# EasyEDA Pro project design.epro, board board_bottom_pcb
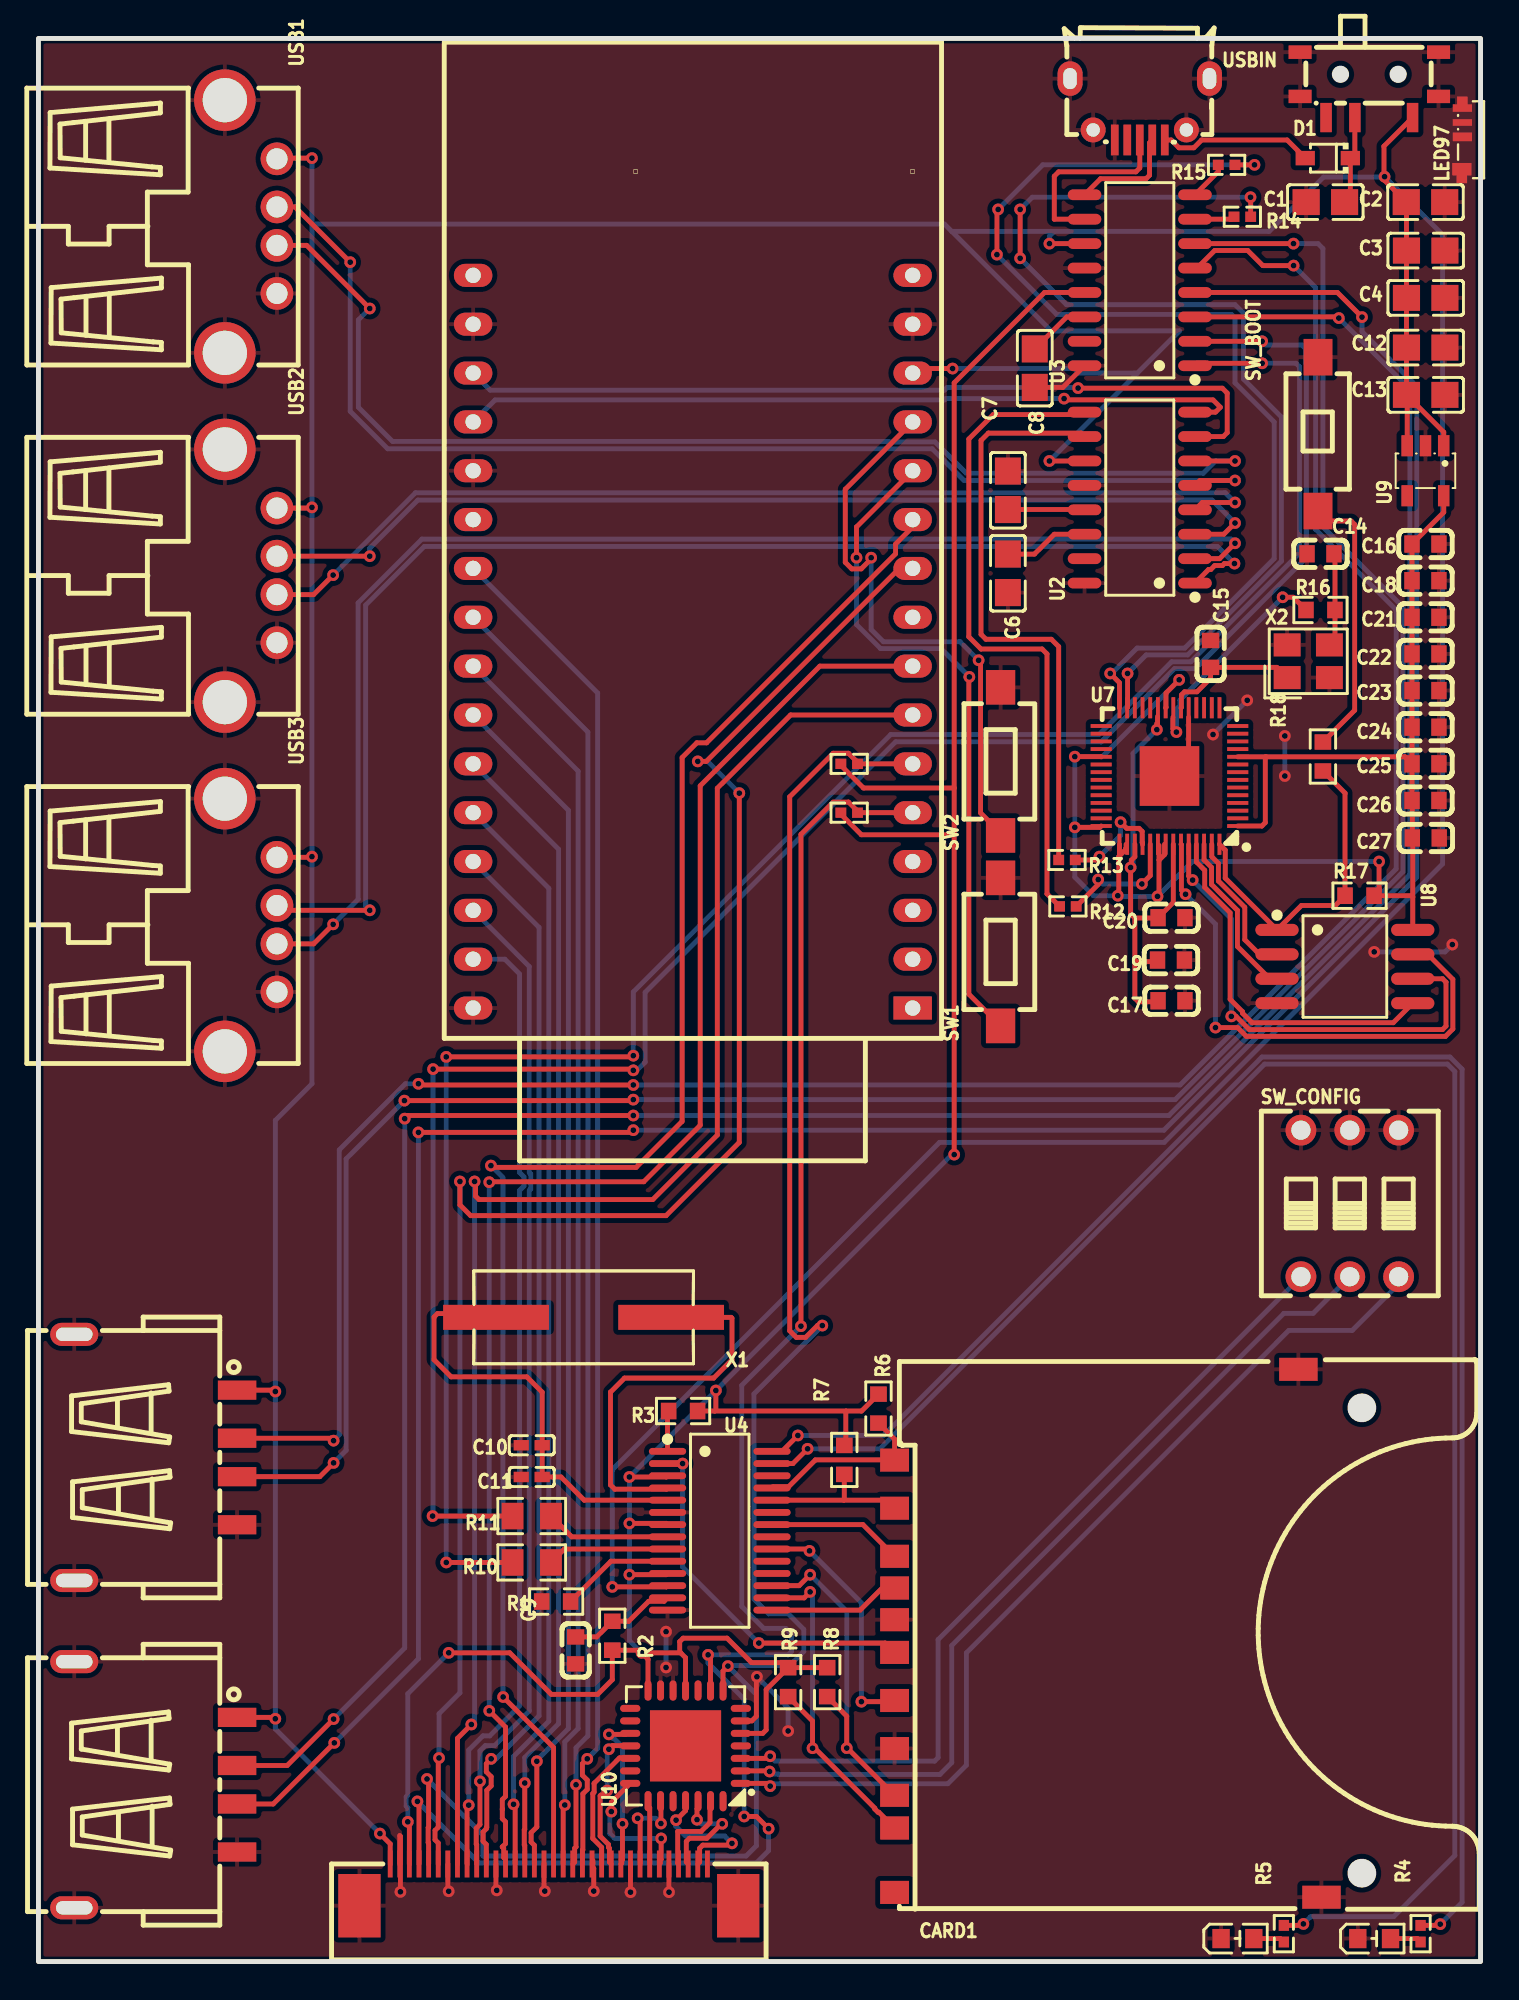
[diagram p11: board, top side]
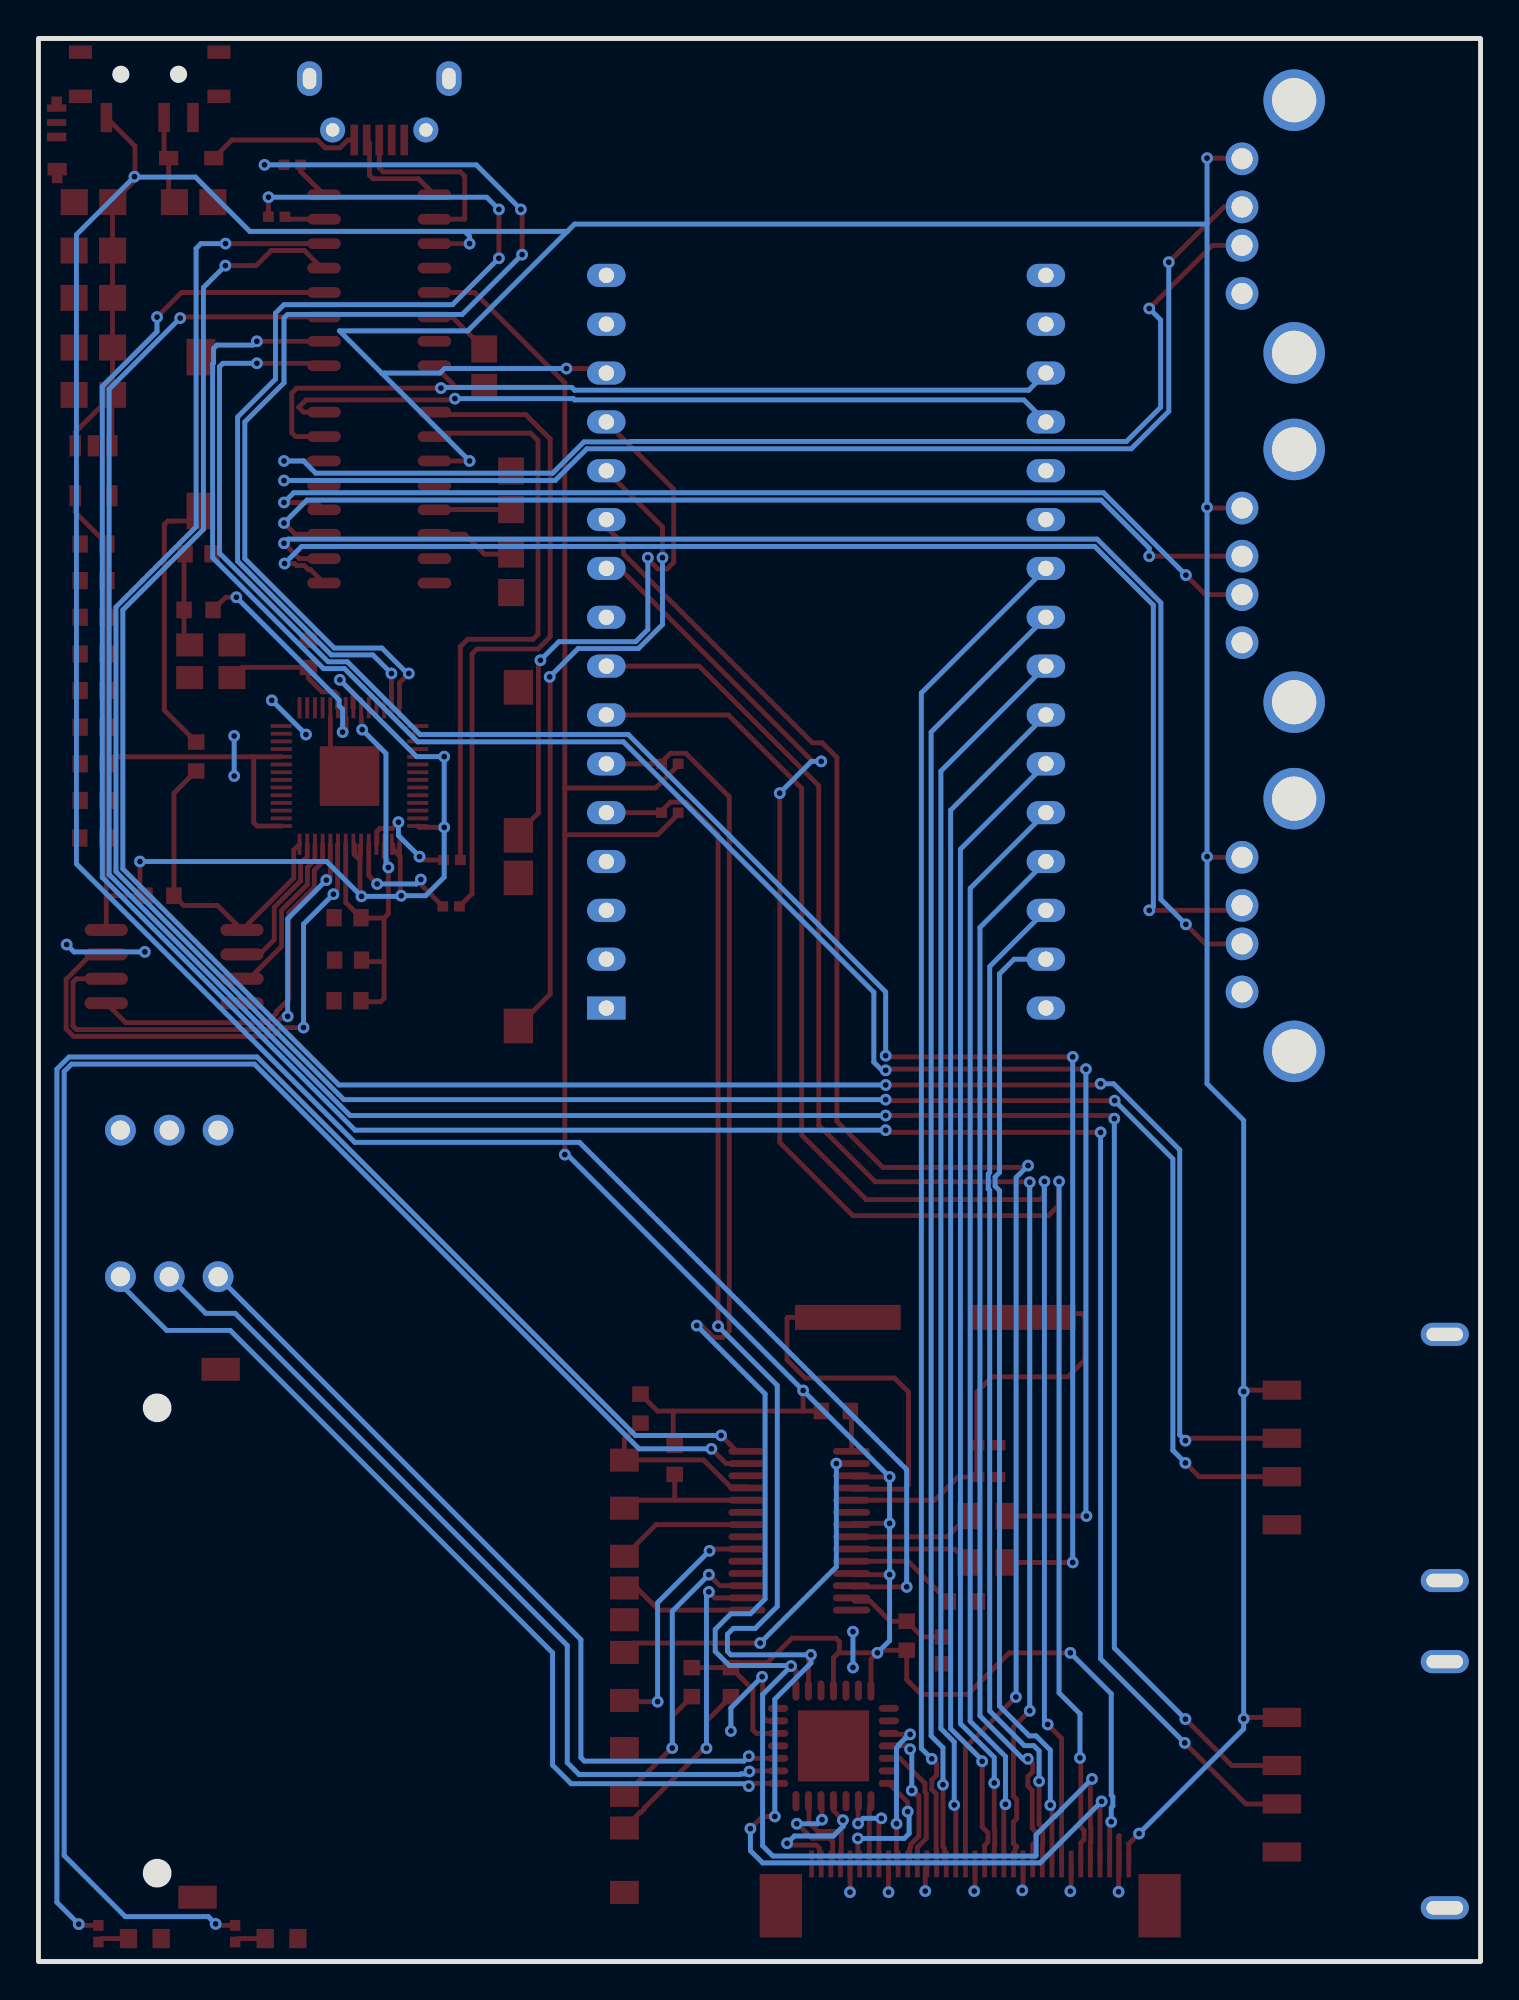
[diagram p12: board, bottom side, seen from below]

Outline 75 x 100 mm; copper layers: Top Layer, Bottom Layer. Coordinates in mm from the lower left corner of the outline.
Outline path: rectangle 0,100 75,0
Stack: Top Layer 0.035mm / Dielectric1 1.51mm FR4 er 4.5 / Bottom Layer 0.035mm

## Design rules (mm)
template: Custom Config
spacing copperThickness1oz (default): track to track 0.102, other pairs 0.152 to 0.3
spacing copperThickness2oz: track to track 0.203, other pairs 0.152 to 0.3
spacing copperThickness0.5oz: track to track 0.051, other pairs 0.152 to 0.3
track width copperThickness1oz (default): min 0.127, default 0.254, max 2.54
track width copperThickness2oz: min 0.203, default 0.254, max 2.54
differential pair differentialPair (default): width min 0.127, default 0.254, max 2.54; gap min 0.152, default 0.152
via viaSize (default): diameter min 0.5, default 0.61, max 10; hole min 0.3, default 0.305, max 6.3
net GND uses copperThickness2oz
net +5V uses copperThickness2oz
net PMOSO uses copperThickness2oz
net VCC uses copperThickness2oz
net 3V3 uses copperThickness2oz
net 1V1 uses copperThickness0.5oz

## Placement (name value [footprint] x y rotation side)
C1  10uF  [C0805]  66.93 91.49 180 top
C2  10uF  [C0805]  72.14 91.49 0 top
C3  10uF  [C0805]  72.15 88.97 0 top
C4  10uF  [C0805]  72.15 86.51 0 top
C6  10uF  [C0805]  50.42 72.19 90 top
C7  10uF  [C0805]  50.42 76.5 270 top
C8  10uF  [C0805]  51.82 82.85 90 top
C9  100nF  [C0603]  27.94 16.18 270 top
C10  20pF  [C0402]  25.65 26.85 0 top
C11  20pF  [C0402]  25.65 25.2 0 top
C12  10uF  [C0805]  72.15 83.93 0 top
C13  10uF  [C0805]  72.15 81.47 0 top
C14  15pF  [C0603]  66.68 73.2 0 top
C15  15pF  [C0603]  60.96 68 270 top
C16  100nF  [C0603]  72.14 73.71 0 top
C17  1uF  [C0603]  58.93 49.96 0 top
C18  1uF  [C0603]  72.14 71.81 180 top
C19  100nF  [C0603]  58.9 52.07 0 top
C20  100nF  [C0603]  58.93 54.28 0 top
C21  100nF  [C0603]  72.14 69.9 0 top
C22  100nF  [C0603]  72.14 68 0 top
C23  100nF  [C0603]  72.14 66.09 0 top
C24  100nF  [C0603]  72.14 64.19 0 top
C25  100nF  [C0603]  72.14 62.28 0 top
C26  100nF  [C0603]  72.14 60.38 0 top
C27  100nF  [C0603]  72.15 58.42 0 top
CARD1  SD-106M  [SD-SMD_SD-106M]  55.63 17.07 90 top
D1  NSR0320MW2T1G  [SOD-323_L1.8-W1.3-LS2.5-RD]  67.06 93.78 180 top
FPC1  AFC07-S34FCC-00  [FPC-SMD_P0.50-34P_LCSXJ-H2.0]  26.54 3.99 180 top
LED97  SK6805SIDE-S  [LED-SMD_4P-L4.0-W1.4_SK6805SIDE-S]  74.04 94.79 90 top
R1  1kΩ  [R0603]  26.92 18.72 0 top
R2  10kΩ  [R0603]  29.84 16.94 90 top
R3  10kΩ  [R0603]  33.53 28.63 180 top
R4  330Ω  [R0402]  71.88 1.45 270 top
R5  330Ω  [R0402]  64.77 1.45 270 top
R6  10kΩ  [R0603]  43.69 28.75 90 top
R7  10kΩ  [R0603]  41.91 26.09 90 top
R8  10kΩ  [R0603]  41.02 14.53 90 top
R9  10kΩ  [R0603]  38.99 14.53 90 top
R10  1Ω  [R0805]  25.65 20.75 0 top
R11  1Ω  [R0805]  25.65 23.16 0 top
R12  27Ω  [R0402]  53.54 54.87 180 top
R13  27Ω  [R0402]  53.49 57.28 180 top
R14  22Ω  [R0402]  62.61 90.73 180 top
R15  22Ω  [R0402]  61.79 93.43 180 top
R16  1kΩ  [R0603]  66.68 70.28 180 top
R17  10kΩ  [R0603]  68.71 55.42 0 top
R18  1kΩ  [R0603]  66.8 62.66 270 top
R19  4.7kΩ  [R0402]  42.16 59.74 180 top
R20  4.7kΩ  [R0402]  42.16 62.28 180 top
SW1  TS3625A  [KEY-SMD_L6.0-W3.5-LS8.4]  50.04 52.5 90 top
SW2  TS3625A  [KEY-SMD_L6.0-W3.5-LS8.4]  50.04 62.41 90 top
SW3  MSK12C02-HB  [SW-TH_MSK12C02-HB-1]  69.22 97.59 180 top
SW_BOOT  TS-1101-C-W  [SW-SMD_L6.0-W3.3-LS8.0]  66.55 79.43 270 top
SW_CONFIG  DSWB03LHGET  [SW-TH_DSWB03LHGET]  68.2 39.42 0 top
U1  -  [ESP32-C6-DevKitC-1]  45.47 49.58 180 top
U2  SL2.1A  [SOP-16_L10.0-W3.9-P1.27-LS6.0-BL]  57.28 76.12 90 top
U3  SL2.1A  [SOP-16_L10.0-W3.9-P1.27-LS6.0-BL]  57.28 87.43 90 top
U4  GL827L-HHY02  [SSOP-28_L9.9-W3.9-P0.64-LS6.0-BL]  35.43 22.4 270 top
U5  APT1608SRCPRV  [LED0603-FD]  69.47 1.19 180 top
U6  APT1608SRCPRV  [LED0603-FD]  62.36 1.19 180 top
U7  RP2040  [LQFN-56_L7.0-W7.0-P0.4-EP]  58.82 61.65 180 top
U8  W25Q128JVSIQ  [SOIC-8_L5.3-W5.3-P1.27-LS8.0-BL]  67.94 51.74 270 top
U9  TLV73333PDBVR  [SOT-23-5_L3.0-W1.7-P0.95-LS2.8-BR]  72.14 77.52 90 top
U10  MCP23017-E/ML  [QFN-28_L6.0-W6.0-P0.65-BL-EP3.7]  33.65 11.21 90 top
USB1  AF 90° WJDG  [USB-A-TH_AF-WJDG]  11.05 90.22 270 top
USB2  AF 90° WJDG  [USB-A-TH_AF-WJDG]  11.05 72.06 270 top
USB3  AF 90° WJDG  [USB-A-TH_AF-WJDG]  11.05 53.9 270 top
USB4  10.0QCHTZ6.8  [USB-A-SMD_10.0QCHTZ6.8]  6.1 26.21 270 top
USB5  10.0QCHTZ6.8  [USB-A-SMD_10.0QCHTZ6.8]  6.1 9.19 270 top
USBIN  MicroXNJ  [MICRO-USB-SMD_MICROXNJ]  57.28 96.32 180 top
X1  12MHz  [HC-49S_L11.4-W4.8]  28.35 33.5 180 top
X2  12MHz  [CRYSTAL-SMD_4P-L3.2-W2.5-BL]  66.04 67.61 0 top

## Footprints (pads in the part's own frame, mm; a bottom-side part is the same pattern mirrored in y, then rotated)
C0402
  rect 0.79x0.54 smd: 1(-0.545,0) 2(0.545,0)
C0603
  rect 0.8x0.9 smd: 1(-0.7,0) 2(0.7,0)
C0805
  rect 1.41x1.35 smd: 1(-1,0) 2(1,0)
CRYSTAL-SMD_4P-L3.2-W2.5-BL
  rect 1.4x1.2 smd: 1(-1.1,-0.85) 2(1.1,-0.85) 3(1.1,0.85) 4(-1.1,0.85)
ESP32-C6-DevKitC-1
  rect 2x1.2 hole 0.8: 1(0,0)
  oval 2x1.2 hole 0.8: 2(0,-2.54) 3(0,-5.08) 4(0,-7.62) 5(0,-10.16) 6(0,-12.7) 7(0,-15.24) 8(0,-17.78) 9(0,-20.32) 10(0,-22.86) 11(0,-25.4) 12(0,-27.94) 13(0,-30.48) 14(0,-33.02) 15(0,-35.56) 16(0,-38.1) 17(22.86,-38.1) 18(22.86,-35.56) 19(22.86,-33.02) 20(22.86,-30.48) 21(22.86,-27.94) 22(22.86,-25.4) 23(22.86,-22.86) 24(22.86,-20.32) 25(22.86,-17.78) 26(22.86,-15.24) 27(22.86,-12.7) 28(22.86,-10.16) 29(22.86,-7.62) 30(22.86,-5.08) 31(22.86,-2.54) 32(22.86,0)
FPC-SMD_P0.50-34P_LCSXJ-H2.0
  rect 0.25x1.4 smd: 1(-8.247,-1.087) 2(-7.747,-1.087) 3(-7.247,-1.087) 4(-6.747,-1.087) 5(-6.247,-1.087) 6(-5.747,-1.087) 7(-5.247,-1.087) 8(-4.747,-1.087) 9(-4.247,-1.087) 10(-3.747,-1.087) 11(-3.247,-1.087) 12(-2.747,-1.087) 13(-2.247,-1.087) 14(-1.747,-1.087) 15(-1.247,-1.087) 16(-0.747,-1.087) 17(-0.247,-1.087) 18(0.251,-1.085) 19(0.751,-1.085) 20(1.251,-1.085) 21(1.751,-1.085) 22(2.251,-1.085) 23(2.751,-1.085) 24(3.251,-1.085) 25(3.751,-1.085) 26(4.251,-1.085) 27(4.751,-1.085) 28(5.251,-1.085) 29(5.751,-1.085) 30(6.251,-1.085) 31(6.751,-1.085) 32(7.253,-1.087) 33(7.753,-1.087) 34(8.248,-1.083)
  rect 2.2x3.3 smd: 35(-9.85,1.087) 36(9.85,1.087)
HC-49S_L11.4-W4.8
  rect 5.5x1.3 smd: 1(-4.553,0) 2(4.553,0)
KEY-SMD_L6.0-W3.5-LS8.4
  rect 1.8x1.524 smd: 1(-3.85,0) 2(3.85,0)
LED0603-FD
  rect 0.9x1 smd: 1(-0.85,0) 2(0.85,0)
LED-SMD_4P-L4.0-W1.4_SK6805SIDE-S
  custom 1.05x1 smd: 1(-1.792,0.014)
  custom 0.45x1 smd: 2(0.087,-0.014)
  custom 0.35x1 smd: 3(0.838,-0.014)
  custom 0.8x1 smd: 4(1.792,-0.014)
LQFN-56_L7.0-W7.0-P0.4-EP
  rect 1.1x0.2 smd: 1(-3.55,2.6) 2(-3.55,2.2) 3(-3.55,1.8) 4(-3.55,1.4) 5(-3.55,1) 6(-3.55,0.6) 7(-3.55,0.2) 8(-3.55,-0.2) 9(-3.55,-0.6) 10(-3.55,-1) 11(-3.55,-1.4) 12(-3.55,-1.8) 13(-3.55,-2.2) 14(-3.55,-2.6) 29(3.55,-2.6) 30(3.55,-2.2) 31(3.55,-1.8) 32(3.55,-1.4) 33(3.55,-1) 34(3.55,-0.6) 35(3.55,-0.2) 36(3.55,0.2) 37(3.55,0.6) 38(3.55,1) 39(3.55,1.4) 40(3.55,1.8) 41(3.55,2.2) 42(3.55,2.6)
  rect 0.2x1.1 smd: 15(-2.6,-3.55) 16(-2.2,-3.55) 17(-1.8,-3.55) 18(-1.4,-3.55) 19(-1,-3.55) 20(-0.6,-3.55) 21(-0.2,-3.55) 22(0.2,-3.55) 23(0.6,-3.55) 24(1,-3.55) 25(1.4,-3.55) 26(1.8,-3.55) 27(2.2,-3.55) 28(2.6,-3.55) 43(2.6,3.55) 44(2.2,3.55) 45(1.8,3.55) 46(1.4,3.55) 47(1,3.55) 48(0.6,3.55) 49(0.2,3.55) 50(-0.2,3.55) 51(-0.6,3.55) 52(-1,3.55) 53(-1.4,3.55) 54(-1.8,3.55) 55(-2.2,3.55) 56(-2.6,3.55)
  rect 3.1x3.1 smd: 57(0,0)
MICRO-USB-SMD_MICROXNJ
  rect 0.4x1.6 smd: 1(-1.3,1.597) 2(-0.65,1.597) 3(0,1.597) 4(0.65,1.597) 5(1.3,1.597)
  round 1.3 hole 0.7: 6(2.425,1.074) 9(-2.425,1.073)
  oval 1.3x1.8 hole 0.7x1.1: 7(3.625,-1.597) 8(-3.625,-1.597)
QFN-28_L6.0-W6.0-P0.65-BL-EP3.7
  oval 0.364x1.055 smd: 1(-1.95,-2.877) 2(-1.3,-2.877) 3(-0.65,-2.877) 4(0,-2.877) 5(0.65,-2.877) 6(1.3,-2.877) 7(1.95,-2.877) 15(1.95,2.877) 16(1.3,2.877) 17(0.65,2.877) 18(0,2.877) 19(-0.65,2.877) 20(-1.3,2.877) 21(-1.95,2.877)
  oval 1.055x0.364 smd: 8(2.877,-1.95) 9(2.877,-1.3) 10(2.877,-0.65) 11(2.877,0) 12(2.877,0.65) 13(2.877,1.3) 14(2.877,1.95) 22(-2.877,1.95) 23(-2.877,1.3) 24(-2.877,0.65) 25(-2.877,0) 26(-2.877,-0.65) 27(-2.877,-1.3) 28(-2.877,-1.95)
  rect 3.7x3.7 smd: 29(0,0)
R0402
  rect 0.566x0.54 smd: 1(-0.433,0) 2(0.433,0)
R0603
  rect 0.806x0.864 smd: 1(-0.753,0) 2(0.753,0)
R0805
  rect 1.133x1.377 smd: 1(-1,0) 2(1,0)
SD-SMD_SD-106M
  rect 1.2x1.5 smd: 1(6.505,11.1) 2(4.005,11.1) 3(0.705,11.1) 4(-0.995,11.1) 5(-3.495,11.1) 6(-5.995,11.1) 7(-8.425,11.1) 8(-10.125,11.1) 9(9.005,11.1) 10(2.355,11.1) 11(-13.475,11.1)
  rect 1.2x2 smd: 12(-13.725,-11.1) 13(13.725,-9.9)
SOD-323_L1.8-W1.3-LS2.5-RD
  rect 1x0.75 smd: 1(-1.173,0) 2(1.173,0)
SOIC-8_L5.3-W5.3-P1.27-LS8.0-BL
  oval 0.63x2.25 smd: 1(-1.905,-3.53) 2(-0.635,-3.53) 3(0.635,-3.53) 4(1.905,-3.53) 5(1.905,3.53) 6(0.635,3.53) 7(-0.635,3.53) 8(-1.905,3.53)
SOP-16_L10.0-W3.9-P1.27-LS6.0-BL
  oval 0.56x1.745 smd: 1(-4.445,-2.873) 2(-3.175,-2.873) 3(-1.905,-2.873) 4(-0.635,-2.873) 5(0.635,-2.873) 6(1.905,-2.873) 7(3.175,-2.873) 8(4.445,-2.873) 9(4.445,2.873) 10(3.175,2.873) 11(1.905,2.873) 12(0.635,2.873) 13(-0.635,2.873) 14(-1.905,2.873) 15(-3.175,2.873) 16(-4.445,2.873)
SOT-23-5_L3.0-W1.7-P0.95-LS2.8-BR
  rect 1.1x0.6 smd: 1(1.3,-0.95) 2(1.3,0) 3(1.3,0.95) 4(-1.3,0.95) 5(-1.3,-0.95)
SSOP-28_L9.9-W3.9-P0.64-LS6.0-BL
  oval 0.355x1.935 smd: 1(-4.128,-2.717) 2(-3.493,-2.717) 3(-2.857,-2.717) 4(-2.223,-2.717) 5(-1.587,-2.717) 6(-0.953,-2.717) 7(-0.318,-2.717) 8(0.318,-2.717) 9(0.953,-2.717) 10(1.587,-2.717) 11(2.223,-2.717) 12(2.857,-2.717) 13(3.493,-2.717) 14(4.128,-2.717) 15(4.128,2.717) 16(3.493,2.717) 17(2.857,2.717) 18(2.223,2.717) 19(1.587,2.717) 20(0.953,2.717) 21(0.318,2.717) 22(-0.318,2.717) 23(-0.953,2.717) 24(-1.587,2.717) 25(-2.223,2.717) 26(-2.857,2.717) 27(-3.493,2.717) 28(-4.128,2.717)
SW-SMD_L6.0-W3.3-LS8.0
  rect 1.9x1.5 smd: 1(-4,0) 2(4,0)
SW-TH_DSWB03LHGET
  round 1.6 hole 1: 1(-2.54,3.81) 2(0,3.81) 3(2.54,3.81) 4(-2.54,-3.81) 5(0,-3.81) 6(2.54,-3.81)
SW-TH_MSK12C02-HB-1
  rect 0.6x1.524 smd: 1(-2.25,1.7) 2(0.75,1.7) 3(2.25,1.7)
  rect 1.2x0.7 smd: 4(-3.6,0.6) 4(-3.6,-1.7) 4(3.6,0.6) 4(3.6,-1.7)
USB-A-SMD_10.0QCHTZ6.8
  rect 1x2 smd: 1(-3.5,4.235) 2(-1,4.235) 3(1,4.235) 4(3.5,4.235)
  oval 1.2x2.5 hole 0.7x1.9: 5(6.4,-4.235) 6(-6.4,-4.235)
USB-A-TH_AF-WJDG
  round 1.7 hole 1.1: 1(-3.521,1.355) 2(-1.018,1.355) 3(0.981,1.355) 4(3.48,1.355)
  round 3.2 hole 2.3: 5(-6.57,-1.355) 5(6.57,-1.355)

## Nets
As in the schematic.

Pads without a net: CARD1 11; LED97 1 2 3 4; SW3 3; U1 1 2 3 4 9 16 17 22; U2 15; U3 15; U4 18 19 21 23 26; U7 2 3 4 5 6 7 8 9 11 12 13 14 15 16 17 18 24 25 26 29 30 31 32 34 35 36 37 38 39 40 41; U9 4; U10 4 7 10 15 16 20 24 28 29; USBIN 4

## Via types
v1: diameter 0.61, hole 0.305, Top Layer to Bottom Layer, 158 vias

## Routing (per net, layer and track width the routed paths; a pad name or vN(x,y) marks a point on that pad's centre or on a via; arc(x,y) is an arc through that point)
1V1: length 24.5
  Top Layer w0.254: 57.02,52 57.02,50.09 57.2,49.91 58.18,49.91 C17.1 ; 57.02,52 57.02,54.26 ; 57.02,52 58.12,52 C19.1 ; v1(58.17,64.06) 58.17,64.37 58.2,64.37 58.2,64.74 ; 57.02,54.26 56.8,54.48 v1(56.8,56.89) 56.84,56.93 56.84,57.27 57.02,57.45 57.02,58.1 ; 57.02,54.26 58.21,54.26 C20.1 59.02,55.07 U7.50
  Bottom Layer w0.254: v1(56.8,56.89) 56.93,57.02 56.93,62.82 v1(58.17,64.06)
3V3: length 83.3
  Top Layer w0.254: C25.1 C26.1 71.45,60.36 C27.1 71.47,58.4 71.47,55.36 ; C25.1 71.07,62.65 63.82,62.65 ; C25.1 C24.1 C23.1 C22.1 C21.1 C18.2 C16.1 73.09,75.36 U9.5 ; v1(69.72,57.2) 69.72,55.69 R17.2 71.41,55.42 71.47,55.36 ; U7.1 63.63,59.05 63.81,59.23 63.81,62.63 63.82,62.65 ; 63.82,62.65 U7.10 ; U7.42 55.2,58.98 v1(53.9,58.98) ; U7.22 58.64,65.22 58.64,65.97 v1(59.33,66.65) ; 58.28,57.27 58.56,57.56 58.56,58.1 ; 58.28,57.27 58.28,55.47 v1(58.2,55.39) ; 58.28,57.27 58.28,58.04 ; 56.22,57.49 56.19,57.46 56.19,55.47 v1(56.13,55.42) ; 56.22,57.49 56.45,57.72 56.54,57.72 56.54,57.86 56.57,57.88 56.57,58.1 ; 56.22,57.49 U7.43 ; v1(53.9,62.65) 55.26,62.65 U7.33 ; 71.47,55.36 U8.8
  Bottom Layer w0.254: v1(59.33,66.65) 55.33,62.65 v1(53.9,62.65) v1(53.9,58.98) 53.9,56.39 54.86,55.42 v1(56.13,55.42) 56.17,55.39 v1(58.2,55.39) 60.01,57.2 v1(69.72,57.2)
+5V: length 322.2
  Top Layer w0.254: v1(17.76,6.66) 18.29,6.12 18.29,5.07 ; U2.11 v1(52.58,78.03) ; USB3.1 14.19,57.42 v1(14.22,57.45) ; v1(14.22,75.62) 14.19,75.58 USB2.1 ; 71.19,81.43 73.09,79.53 U9.1 ; 71.19,81.43 U9.3 ; 71.19,81.43 C13.1 C12.1 C4.1 C3.1 71.15,91.48 C2.1 70.01,92.62 v1(70.01,92.81) 69.98,92.84 69.98,94.4 SW3.1 ; v1(12.32,12.62) 12.25,12.69 USB5.1 ; v1(47.54,82.84) 45.7,82.84 U1.14 ; USB4.1 12.25,29.71 v1(12.32,29.64) ; v1(29.84,19.48) 32.65,19.48 U4.12 ; v1(14.22,93.78) 12.44,93.78 USB1.1 ; v1(52.58,89.33) U3.11
  Bottom Layer w0.254: 52.83,89.97 47.5,89.97 ; 52.83,89.97 52.58,89.71 v1(52.58,89.33) ; 52.83,89.97 64.01,89.97 66.83,92.79 69.99,92.79 v1(70.01,92.81) 73.03,89.8 73.03,57.08 58.54,42.6 46.86,42.6 29.84,25.58 v1(29.84,19.48) ; 47.5,89.97 52.67,84.79 59.34,84.79 57.13,82.58 ; 47.5,89.97 47.12,90.35 14.22,90.35 ; 14.22,90.35 v1(14.22,75.62) v1(14.22,57.45) 14.22,45.64 12.32,43.74 v1(12.32,29.64) v1(12.32,12.62) 12.32,12.1 v1(17.76,6.66) ; 14.22,90.35 v1(14.22,93.78) ; 57.13,82.58 57.04,82.58 57.02,82.6 54.12,82.6 53.88,82.84 v1(47.54,82.84) ; 57.13,82.58 v1(52.58,78.03)
GND: length 36.9
  Top Layer w0.254: FPC1.5 32.79,3.61 v1(32.79,3.61) ; 28.83,5.26 28.83,5.12 ; 28.83,5.12 FPC1.13 ; 28.83,5.12 28.83,4.89 28.88,4.84 v1(28.88,3.66) ; v1(37.37,14.81) 37.34,14.78 37.34,12.75 37.1,12.51 U10.6 ; U3.16 53.28,81.85 C8.1 ; FPC1.33 18.79,6.55 18.83,6.51 v1(18.83,3.63) ; U7.57 59.82,62.64 59.82,64.69 ; v1(23.84,3.7) 23.79,3.74 FPC1.23 ; FPC1.9 v1(30.79,3.61) ; v1(21.34,3.66) 21.29,3.7 FPC1.28 ; v1(26.33,3.66) 26.29,3.7 FPC1.18
  Bottom Layer w0.254: v1(62.87,65.58) v1(61.09,63.8) ; v1(38.99,11.99) 38.99,13.18 v1(37.37,14.81) ; v1(69.47,52.5) 73.15,52.5 v1(73.53,52.88) ; v1(32.64,15.29) v1(32.64,17.15) ; v1(64.82,63.73) v1(64.82,61.65)
VCC: length 158.8
  Top Layer w0.254: v1(30.73,25.2) 32.65,25.2 U4.3 ; R19.2 41.69,59.7 42.8,58.59 47.62,58.59 ; 47.62,58.59 v1(47.62,41.96) ; 47.62,58.59 47.62,61.02 ; U10.5 37.67,11.86 37.85,12.04 37.85,14.14 R9.2 ; 41.99,28.63 41.99,26.92 R7.2 ; 41.99,28.63 35.18,28.63 ; 41.99,28.63 42.81,28.63 R6.2 ; U4.7 32.65,22.78 v1(30.73,22.78) ; FPC1.32 19.29,7.18 v1(19.21,7.27) ; v1(30.73,20.12) 32.65,20.12 U4.11 ; R9.2 38.73,15.54 37.08,15.54 35.81,16.81 33.53,16.81 33.35,16.64 33.35,16.11 33.4,16.05 ; R9.2 R8.2 ; 35.18,28.63 35.23,28.68 v1(35.23,29.69) ; 35.18,28.63 R3.1 ; v1(21.34,16.05) 24.51,16.05 26.67,13.89 29.08,13.89 29.84,14.66 R2.1 31.23,16.19 v1(31.37,16.05) ; U3.13 52.32,86.79 47.62,82.09 47.62,61.02 ; 33.4,16.05 33.65,15.8 U10.11 ; 33.4,16.05 v1(31.37,16.05) ; R20.2 41.73,62.2 42.91,61.02 47.62,61.02 ; U10.14 31.7,15.72 v1(31.37,16.05)
  Bottom Layer w0.254: v1(19.21,7.27) 19.21,8 19.12,8.08 19.12,8.57 19.21,8.65 19.21,13.92 v1(21.34,16.05) ; v1(31.37,16.05) 30.73,16.69 v1(30.73,20.12) ; v1(30.73,22.78) 30.73,20.24 ; 30.8,20.18 30.86,20.12 ; v1(47.62,41.96) 47.5,41.96 v1(35.23,29.69) v1(30.73,25.2) 30.73,22.91 30.86,22.78
1QSPI_SCLK: length 25.5
  Top Layer w0.254: v1(62.04,49.15) 62.28,49.15 62.97,48.46 73.03,48.46 73.2,48.64 73.2,50.93 73.03,51.1 U8.6 ; v1(60.03,56.24) 59.82,56.44 U7.52
  Bottom Layer w0.254: v1(62.04,49.15) 62.04,54.22 v1(60.03,56.24)
1QSPI_SD0: length 19.3
  Top Layer w0.254: U7.53 60.22,57.18 60.65,56.74 60.65,55.86 61.98,54.54 61.98,50.04 62.62,49.39 62.62,49.31 63.12,48.82 70.46,48.82 U8.5
1QSPI_SD1: length 7.7
  Top Layer w0.254: U7.55 61.02,57.45 61.37,57.11 61.37,56.19 62.74,54.82 62.74,53.14 63.5,52.37 U8.2
1QSPI_SD2: length 8.8
  Top Layer w0.254: U8.3 64.03,51.1 62.36,52.78 62.36,54.66 61.01,56.01 61.01,56.9 60.62,57.29 U7.54
1QSPI_SD3: length 28.2
  Top Layer w0.254: v1(61.21,48.57) 62.37,48.57 62.82,48.11 73.17,48.11 73.56,48.49 73.56,51.07 72.26,52.37 U8.7 ; U7.51 59.44,58.08 59.44,55.72 v1(59.66,55.5)
  Bottom Layer w0.254: 61.21,48.57 61.21,53.94 v1(59.66,55.5)
1QSPI_SS: length 16.9
  Top Layer w0.254: R18.2 67.95,60.76 R17.1 67.45,54.91 65.69,54.91 U8.1 61.72,56.34 61.72,57.8 U7.56
1XIN: length 7.3
  Top Layer w0.254: U7.20 59.44,65.22 59.44,65.86 59.61,66.03 60.25,66.03 60.96,66.74 C15.2 64.41,67.3 X2.1
1XOUT: length 11.6
  Top Layer w0.254: R16.2 65.26,70.94 v1(64.71,70.94) ; v1(59.18,63.93) 59,64.11 59,64.69
  Bottom Layer w0.254: v1(64.71,70.94) 59.36,65.6 59.36,65.3 59.18,65.12 v1(59.18,63.93)
CONT_DM: length 43.6
  Top Layer w0.254: v1(54.07,81.82) 54.08,81.81 61.57,81.81 61.82,81.56 61.82,79.5 61.62,79.3 U2.7
  Bottom Layer w0.254: U1.19 23.5,81.71 47.12,81.71 47.26,81.85 54.03,81.85 v1(54.07,81.82)
CONT_DP: length 41
  Top Layer w0.254: U2.8 61.21,80.57 61.47,80.82 61.09,81.2 53.41,81.2 v1(53.34,81.27)
  Bottom Layer w0.254: v1(53.34,81.27) 47.18,81.27 47.12,81.2 23.75,81.2 U1.20
LED_IN: length 90
  Top Layer w0.254: FPC1.29 20.79,6.17 20.62,6.33 20.62,6.82 20.79,6.99 20.79,10.54 v1(20.83,10.59) ; U1.10 44.77,72.44 34.73,62.41 v1(34.29,62.41) ; v1(36.45,60.76) 36.45,42.6 32.64,38.79 22.48,38.79 21.92,39.34 v1(21.92,40.56)
  Bottom Layer w0.254: v1(34.29,62.41) 34.8,62.41 v1(36.45,60.76) ; v1(21.92,40.56) 21.92,13.97 20.83,12.88 v1(20.83,10.59)
MUL0_A0: length 50.5
  Top Layer w0.254: FPC1.26 22.29,8.05 v1(22.38,8.13)
  Bottom Layer w0.254: U1.31 24.26,52.12 25.02,51.36 25.02,41.03 25.25,40.81 25.25,40.32 25.02,40.09 25.02,13.28 23.47,11.73 23.11,11.73 22.38,11 v1(22.38,8.13)
MUL0_A1: length 52.3
  Top Layer w0.254: v1(22.96,9.37) 22.96,7.12 22.77,6.93 22.77,6.1 22.79,6.08 FPC1.25
  Bottom Layer w0.254: v1(22.96,9.37) 22.96,10.95 23.24,11.23 23.72,11.23 25.53,13.03 25.53,40.1 25.6,40.17 25.6,40.95 25.53,41.03 25.53,51.74 U1.30
MUL0_A2: length 55.2
  Top Layer w0.254: v1(23.54,10.54) 23.29,10.29 23.29,9.87 23.54,9.61 23.54,9.13 23.32,8.9 23.32,6.98 23.29,6.95 23.29,6.9 23.12,6.74 23.12,6.25 23.29,6.08 FPC1.24
  Bottom Layer w0.254: v1(23.54,10.54) 23.8,10.54 26.03,12.78 26.03,53.77 U1.29
MUL0_OUT: length 80.5
  Top Layer w0.254: FPC1.27 21.79,11.61 v1(22.51,12.33) ; v1(22.68,40.56) 22.73,40.51 22.73,39.8 22.91,39.62 31.95,39.62 35.31,42.98 35.31,61.01 39.12,64.82 U1.7
  Bottom Layer w0.254: v1(22.68,40.56) 22.68,12.5 v1(22.51,12.33)
MUL1_A0: length 57.1
  Top Layer w0.254: v1(24.71,8.18) 24.79,8.09 FPC1.21
  Bottom Layer w0.254: v1(24.71,8.18) 24.71,10.66 26.54,12.5 26.54,55.8 U1.28
MUL1_A1: length 59.8
  Top Layer w0.254: FPC1.20 25.29,6.04 25.27,6.07 25.27,6.85 25.29,6.87 v1(25.29,9.28)
  Bottom Layer w0.254: v1(25.29,9.28) 25.29,10.61 27.05,12.37 27.05,57.84 U1.27
MUL1_A2: length 62.7
  Top Layer w0.254: v1(25.92,10.41) 25.92,7 25.62,6.7 25.62,6.21 25.79,6.04 FPC1.19
  Bottom Layer w0.254: v1(25.92,10.41) 25.92,10.47 27.56,12.11 27.56,59.87 U1.26
MUL1_OUT: length 79.6
  Top Layer w0.254: v1(23.44,40.52) 23.47,40.55 31.48,40.55 34.42,43.48 34.42,61.14 40.64,67.36 U1.8 ; v1(23.45,13.04) 24.29,12.19 24.29,8.59 24.12,8.42 24.12,7.94 24.14,7.92 24.12,7.91 24.12,7.43 24.29,7.26 24.29,6.13 24.12,5.96 24.12,5.96 24.2,5.89 24.2,5.41 24.29,5.31 FPC1.22
  Bottom Layer w0.254: v1(23.45,13.04) 23.44,13.04 v1(23.44,40.52)
MUL2_A0: length 64.9
  Top Layer w0.254: FPC1.16 27.29,8.06 v1(27.37,8.14)
  Bottom Layer w0.254: U1.25 28.07,61.9 28.07,12.12 27.37,11.42 v1(27.37,8.14)
MUL2_A1: length 67.6
  Top Layer w0.254: v1(27.96,9.19) 27.96,5.96 27.89,5.89 27.89,5.17 FPC1.15
  Bottom Layer w0.254: U1.24 28.57,63.93 28.57,11.73 27.96,11.12 v1(27.96,9.19)
MUL2_A2: length 70.6
  Top Layer w0.254: v1(28.54,10.54) 28.29,10.29 28.29,9.69 28.54,9.44 28.54,8.95 28.31,8.72 28.31,5.81 28.29,5.79 FPC1.14
  Bottom Layer w0.254: v1(28.54,10.54) 29.08,11.08 29.08,65.96 U1.23
MUL2_OUT: length 85.2
  Top Layer w0.254: FPC1.17 26.79,11.13 v1(24.17,13.76) ; v1(23.53,41.39) 23.63,41.3 31.08,41.3 33.48,43.69 33.48,62.61 34.24,63.37 34.75,63.37 44.58,73.2 44.58,73.71 45.47,74.6 U1.11
  Bottom Layer w0.254: v1(23.53,41.39) 24.15,40.77 24.15,13.77 v1(24.17,13.76)
PMOSO: length 18.2
  Top Layer w0.254: v1(37.47,16.56) 44.04,16.56 CARD1.4
  Bottom Layer w0.254: v1(33.5,25.9) 33.5,20.52 v1(37.47,16.56)
RE1_CLK: length 7.6
  Top Layer w0.254: U10.18 30.76,11.23 29.86,11.23 v1(29.67,11.04) ; FPC1.11 29.69,5.17 29.69,5.89 29.65,5.94 29.65,6.09 29.21,6.52 29.21,8.61 29.25,8.66 29.34,8.66 v1(29.58,8.89)
  Bottom Layer w0.254: v1(29.67,11.04) 29.58,10.95 v1(29.58,8.89)
RE1_DT: length 8.2
  Top Layer w0.254: U10.17 30.59,11.86 30.53,11.81 v1(29.67,11.81) ; FPC1.10 30.33,5.12 30.33,5.26 30.37,5.3 v1(30.37,7.16)
  Bottom Layer w0.254: v1(30.37,7.16) 30.37,7.55 30.38,7.56 30.38,8.04 30.37,8.04 30.37,11.11 30.25,11.23 30.25,11.28 29.91,11.62 29.86,11.62 v1(29.67,11.81)
RE1_SW: length 7.1
  Top Layer w0.254: FPC1.12 29.29,5.94 28.83,6.4 28.83,8.74 28.9,8.81 28.9,9.27 30.22,10.59 31.06,10.59
RE2_CLK: length 3
  Top Layer w0.254: FPC1.7 31.79,8 31.7,8.08
RE2_DT: length 7.2
  Top Layer w0.254: U10.21 29.79,8.28 v1(29.79,7.8) ; FPC1.6 32.33,5.12 32.33,5.26 32.38,5.32 v1(32.38,6.4)
  Bottom Layer w0.254: v1(29.79,7.8) 29.72,7.72 29.72,6.66 29.97,6.4 v1(32.38,6.4)
RE2_SW: length 4.7
  Top Layer w0.254: 32.35,8.08 32.37,8.06 v1(32.37,7.18) ; FPC1.8 31.29,7.32 v1(31.16,7.45)
  Bottom Layer w0.254: v1(31.16,7.45) 32.1,7.45 v1(32.37,7.18)
RE3_CLK: length 5.6
  Top Layer w0.254: 34.3,8.08 34.3,7.99 34.25,7.94 v1(34.25,7.38) ; v1(35.56,7.16) 35.54,7.18 34.77,6.41 33.86,6.41 33.69,6.25 33.69,5.17 FPC1.3
  Bottom Layer w0.254: v1(35.56,7.16) 34.46,7.16 v1(34.25,7.38)
RE3_DT: length 7.2
  Top Layer w0.254: FPC1.2 34.39,5.17 34.39,5.89 34.55,6.05 35.97,6.05 v1(36.07,6.15) ; v1(33.16,7.35) 33.65,7.84 33.65,8.08
  Bottom Layer w0.254: v1(33.16,7.35) 33.15,7.34 33.15,7.04 33.66,6.53 35.69,6.53 v1(36.07,6.15)
RE3_SW: length 4.4
  Top Layer w0.254: FPC1.4 33.25,5.12 33.25,6.77 34.46,6.77 34.93,7.23 34.93,8.05 34.95,8.08
RMIN_DM: length 2.1
  Top Layer w0.254: R14.2 62.05,90.6 60.15,90.6
RMIN_DP: length 2.1
  Top Layer w0.254: 61.36,93.43 61.36,93.08 U3.8
RMOUT_DM: length 34.7
  Top Layer w0.254: R12.2 52.45,55.52 52.45,68 52.2,68.25 49.02,68.25 48.39,68.88 48.39,79.17 49.66,80.44 54.28,80.44 U2.9
RMOUT_DP: length 31.1
  Top Layer w0.254: R13.2 53.06,68.38 52.68,68.76 49.28,68.76 49.02,69.01 49.02,79.1 49.4,79.48 54.22,79.48 U2.10
SCL: length 97.3
  Top Layer w0.254: U10.8 35.6,15.11 v1(35.86,15.36) ; v1(20.21,9.49) 20.29,9.41 20.29,6.99 20.27,6.97 20.27,6.19 20.29,6.16 FPC1.30 ; U1.6 R20.1 42.6,62.36 42.13,62.83 41.33,62.83 39.07,60.57 39.07,32.8 39.41,32.46 39.9,32.46 40.51,33.07 v1(40.77,33.07)
  Bottom Layer w0.254: v1(40.77,33.07) 37.21,29.52 37.21,18.85 37.97,18.08 38.99,18.08 39.8,17.27 39.8,16.13 39.07,15.39 35.89,15.39 v1(35.86,15.36) 37.34,13.88 37.34,6.02 36.81,5.49 23.14,5.49 23.11,5.51 23.11,6.59 22.15,7.55 22.13,7.55 21.79,7.89 21.79,7.91 v1(20.21,9.49)
SD_CD: length 6.9
  Top Layer w0.254: CARD1.10 44.47,19.48 43.94,19.48 42.74,18.28 U4.15
SD_CLK: length 12.7
  Top Layer w0.254: CARD1.5 44.47,13.51 v1(42.8,13.51) ; U4.20 40,21.45 v1(40.1,21.35)
  Bottom Layer w0.254: v1(40.1,21.35) 42.8,18.66 v1(42.8,13.51)
SD_CMD: length 7.1
  Top Layer w0.254: CARD1.2 42.88,22.72 U4.22
SD_DAT0: length 18.6
  Top Layer w0.254: U4.17 39.56,19.55 v1(40.13,20.12) ; R8.1 42.04,12.76 v1(42.04,11.1) 42.07,11.1 CARD1.7
  Bottom Layer w0.254: v1(42.04,11.1) 42.04,18.21 v1(40.13,20.12)
SD_DAT1: length 19.5
  Top Layer w0.254: R9.1 40.26,12.51 v1(40.26,11.09) 40.38,11.09 43.5,7.97 43.5,7.93 43.66,7.76 43.71,7.76 CARD1.8 ; v1(40.13,19.22) 39.82,18.91 U4.16
  Bottom Layer w0.254: v1(40.26,11.09) 40.26,19.09 v1(40.13,19.22)
SD_DAT2: length 9.3
  Top Layer w0.254: R6.1 44.53,27.16 CARD1.9 44.51,26.09 40.41,26.09 39.01,24.69 38.21,24.69 U4.25
SD_DAT3: length 7.9
  Top Layer w0.254: 41.88,23.99 41.91,24.02 R7.1 ; 41.88,23.99 44.11,23.99 CARD1.1 ; 41.88,23.99 U4.24
SD_DM: length 102.2
  Top Layer w0.254: v1(63.64,83.11) 60.28,83.11 U3.1 ; v1(21.21,20.75) R10.1 ; v1(21.21,47.04) 30.87,47.04 v1(30.94,47.1)
  Bottom Layer w0.254: v1(21.21,47.04) v1(21.21,20.75) ; v1(30.94,47.1) 30.94,50.42 44.32,63.8 55.15,63.8 58.94,67.59 59.93,67.59 65.58,73.24 65.58,82.93 65.41,83.11 v1(63.64,83.11)
SD_DP: length 102.8
  Top Layer w0.254: U3.2 v1(63.64,84.25) ; v1(30.94,46.34) 30.87,46.41 v1(20.52,46.41) ; v1(20.5,23.16) R11.1
  Bottom Layer w0.254: v1(20.5,23.16) 20.52,23.19 v1(20.52,46.41) ; v1(63.64,84.25) 63.84,84.05 65.72,84.05 65.9,83.88 65.9,83.12 65.94,83.08 65.94,73 60.17,67.23 59.08,67.23 55.28,63.42 44.58,63.42 31.55,50.4 31.55,46.77 31.11,46.32 30.96,46.32 v1(30.94,46.34)
SDA: length 93.6
  Top Layer w0.254: v1(34.83,15.95) 34.95,15.82 U10.9 ; FPC1.31 19.79,8.24 v1(19.71,8.33) ; v1(39.66,33.04) 39.66,58.61 41.33,60.29 42.13,60.29 42.6,59.82 R19.1 U1.5 ; v1(37.97,6.91) 37.34,7.54 v1(36.7,7.54)
  Bottom Layer w0.254: v1(39.66,33.04) 36.58,29.96 36.58,18.47 37.72,17.32 38.86,17.32 39.17,17.02 39.17,16.13 38.99,15.95 v1(34.83,15.95) 34.83,15.52 36.7,13.64 v1(36.7,7.54) ; v1(19.71,8.33) 22.9,5.13 37.34,5.13 37.97,5.77 v1(37.97,6.91)
USB1_DM: length 62.4
  Top Layer w0.254: U2.5 60.4,77.01 v1(62.23,77.01) ; USB1.2 13.34,91.24 v1(16.21,88.37)
  Bottom Layer w0.254: v1(62.23,77.01) 48.13,77.01 46.48,78.66 18.16,78.66 16.21,80.61 v1(16.21,88.37)
USB1_DP: length 60.9
  Top Layer w0.254: v1(17.23,85.96) 13.95,89.24 USB1.3 ; v1(62.23,78.03) U2.6
  Bottom Layer w0.254: v1(17.23,85.96) 16.64,85.36 16.64,80.82 18.41,79.04 44.2,79.04 44.22,79.02 46.63,79.02 48.26,77.39 60.58,77.39 61.21,78.03 v1(62.23,78.03)
USB2_DM: length 54.1
  Top Layer w0.254: U2.3 61.65,74.22 v1(62.23,74.8) ; USB2.2 v1(17.23,73.08)
  Bottom Layer w0.254: v1(62.23,74.8) 61.03,76 19.73,76 17.23,73.5 v1(17.23,73.08)
USB2_DP: length 54.5
  Top Layer w0.254: USB2.3 14.31,71.08 v1(15.33,72.1) ; U2.4 60.53,75.87 v1(62.23,75.87)
  Bottom Layer w0.254: v1(62.23,75.87) 61.72,76.38 19.61,76.38 v1(15.33,72.1)
USB3_DM: length 70.2
  Top Layer w0.254: USB3.2 12.66,54.66 v1(17.23,54.66) ; U2.1 60.86,72.39 60.97,72.39 61.18,72.59 61.58,72.59 61.68,72.69 v1(62.2,72.69)
  Bottom Layer w0.254: v1(62.2,72.69) 61.31,73.58 20.07,73.58 17.02,70.54 17.02,54.88 v1(17.23,54.66)
USB3_DP: length 70.1
  Top Layer w0.254: v1(62.23,73.75) 61.43,72.95 U2.2 ; v1(15.33,53.93) 14.31,52.92 USB3.3
  Bottom Layer w0.254: v1(15.33,53.93) 16.63,55.24 16.63,70.65 19.94,73.96 62.02,73.96 v1(62.23,73.75)
USB4_DM: length 120.8
  Top Layer w0.254: v1(15.35,27.09) 15.22,27.21 USB4.2 ; v1(30.94,45.58) 19.82,45.58 v1(19.76,45.64) ; v1(65.28,88.19) 63.68,88.19 62.89,88.98 61.18,88.98 60.26,88.06 60.15,88.06
  Bottom Layer w0.254: v1(30.94,45.58) 59.37,45.58 70.61,56.82 70.61,70.28 66.42,74.47 66.42,87.05 v1(65.28,88.19) ; v1(19.76,45.64) 19.08,45.64 15.65,42.21 15.65,27.38 v1(15.35,27.09)
USB4_DP: length 123.4
  Top Layer w0.254: v1(30.94,44.82) 30.88,44.77 v1(19.03,44.77) ; USB4.3 14.63,25.21 v1(15.35,25.93) ; v1(65.27,89.33) U3.6
  Bottom Layer w0.254: v1(19.03,44.77) 16,41.74 16,26.58 v1(15.35,25.93) ; v1(65.27,89.33) 66.55,89.33 66.8,89.08 66.8,74.6 69.6,71.81 69.6,71.8 70.97,70.43 70.97,56.67 59.11,44.82 v1(30.94,44.82)
USB5_DM: length 134.3
  Top Layer w0.254: USB5.2 12.94,10.19 v1(15.35,12.61) ; v1(30.94,43.99) 19.21,43.99 v1(19.05,43.83) ; v1(67.63,85.46) 67.57,85.52 U3.3
  Bottom Layer w0.254: v1(67.63,85.46) 71.32,81.76 71.32,56.52 58.79,43.99 v1(30.94,43.99) ; v1(15.35,12.61) 19.05,16.31 v1(19.05,43.83)
USB5_DP: length 136.9
  Top Layer w0.254: v1(15.39,11.37) 12.21,8.19 USB5.3 ; v1(68.84,85.51) 67.55,86.79 U3.4 ; v1(30.94,43.23) 30.82,43.12 v1(19.76,43.12)
  Bottom Layer w0.254: v1(19.76,43.12) 19.76,15.74 v1(15.39,11.37) ; v1(30.94,43.23) 58.53,43.23 71.68,56.38 71.68,81.91 68.84,84.76 v1(68.84,85.51)
USBIN_DM: length 5.7
  Top Layer w0.254: USBIN.2 57.78,94.58 57.78,92.89 57.61,92.71 55.24,92.71 U3.9
USBIN_DP: length 9.9
  Top Layer w0.254: 54.4,90.6 52.83,90.6 52.83,92.84 53.06,93.06 57.07,93.06 57.28,93.27 USBIN.3
$1N2452: length 48.9
  Top Layer w0.254: U10.1 37.91,9.26 v1(38.06,9.12)
  Bottom Layer w0.254: SW_CONFIG.6 70.74,35.23 68.33,32.82 65.02,32.82 48.26,16.05 48.26,10.21 47.3,9.25 38.18,9.25 v1(38.06,9.12)
$1N2456: length 46
  Top Layer w0.254: U10.2 37.99,9.91 v1(38.02,9.88)
  Bottom Layer w0.254: v1(38.02,9.88) 38.15,9.76 38.47,9.76 38.5,9.73 46.88,9.73 47.5,10.34 47.5,16.43 64.77,33.71 66.29,33.71 SW_CONFIG.5
$1N2461: length 43.3
  Top Layer w0.254: U10.3 37.94,10.56 v1(38.06,10.68)
  Bottom Layer w0.254: SW_CONFIG.4 46.79,16.74 46.79,10.6 46.61,10.42 38.31,10.42 v1(38.06,10.68)
$1N2542: length 35
  Top Layer w0.254: SW1.1 48.39,50.3 48.39,66.77 v1(48.41,66.8) ; v1(42.54,73) 42.54,74.6 U1.12
  Bottom Layer w0.254: v1(42.54,73) 42.54,69.52 43.79,68.27 46.94,68.27 v1(48.41,66.8)
$1N2585: length 30.1
  Top Layer w0.254: v1(43.31,73) 43.31,72.94 42.79,72.42 42.3,72.42 41.96,72.76 41.96,76.56 U1.13 ; v1(48.9,67.67) 49,67.56 49,59.73 50.04,58.68 SW2.1
  Bottom Layer w0.254: v1(43.31,73) 43.31,69.27 43.94,68.63 47.93,68.63 v1(48.9,67.67)
$2N2231: length 8
  Top Layer w0.254: USBIN.1 58.91,94.72 59.32,94.31 60.09,94.31 60.49,94.72 64.94,94.72 D1.2
$2N2281: length 4.6
  Top Layer w0.254: C1.1 68.23,91.79 D1.1 68.47,94.01 SW3.2
$2N3368: length 3.3
  Top Layer w0.254: U3.14 53.48,85.52 C8.2
$2N3458: length 4.4
  Top Layer w0.254: C6.2 51.8,73.19 52.83,74.22 U2.14
$2N3463: length 4
  Top Layer w0.254: U2.13 54.39,75.5 C7.2
$3N1914: length 5.9
  Top Layer w0.254: R1.2 29.77,20.82 U4.10
$3N2120: length 2.1
  Top Layer w0.254: U4.1 32.72,28.57 R3.2
$3N2259: length 20.3
  Top Layer w0.254: U4.4 32.65,24.56 29.97,24.56 29.75,24.78 29.75,29.61 30.48,30.34 35.12,30.34 36.07,31.29 36.07,33.45 36.02,33.5 X1.1
$3N2263: length 23.4
  Top Layer w0.254: U4.5 28.38,23.99 27.18,25.2 26.2,25.2 26.2,29.6 25.4,30.4 21.46,30.4 20.57,31.29 20.57,33.52 20.75,33.69 23.6,33.69 X1.2
$3N2426: length 5.6
  Top Layer w0.254: C9.1 29.03,16.88 R2.2 30.7,17.7 31.74,18.73 32.54,18.73 U4.13
$3N2556: length 90.6
  Top Layer w0.254: R4.1 72.84,1.88 v1(72.91,1.94) ; v1(39.5,27.36) 38.67,26.53 U4.28
  Bottom Layer w0.254: v1(39.5,27.36) 43.95,27.36 63.63,47.04 73.41,47.04 74.04,46.41 74.04,3.08 v1(72.91,1.94)
$3N2560: length 95.4
  Top Layer w0.254: R5.1 65.71,1.88 v1(65.79,1.96) ; U4.27 39.24,25.9 v1(40,26.66)
  Bottom Layer w0.254: v1(40,26.66) 43.76,26.66 63.77,46.67 73.28,46.67 73.66,46.28 73.66,5.51 70.49,2.34 66.17,2.34 v1(65.79,1.96)
$3N2602: length 1.6
  Top Layer w0.254: U5.1 71.7,1.19 R4.2
$3N2642: length 1.6
  Top Layer w0.254: U6.1 64.59,1.19 R5.2
$3N3390: length 6.4
  Top Layer w0.254: U4.9 27.35,21.45 R10.2
$3N3470: length 6.5
  Top Layer w0.254: R11.2 27.73,22.09 U4.8
$5N921: length 6.5
  Top Layer w0.254: U7.47 57.82,56.47 v1(57.39,56.03) ; v1(55.12,56.26) 55.12,56.01 R12.1
  Bottom Layer w0.254: v1(57.39,56.03) 55.35,56.03 v1(55.12,56.26)
$5N964: length 5.6
  Top Layer w0.254: v1(55.18,57.46) 55.01,57.28 53.93,57.28 ; v1(56.28,59.25) 56.6,58.93 57.24,58.93 57.4,58.76 57.4,58.19 57.42,58.17 U7.46
  Bottom Layer w0.254: v1(55.18,57.46) 56.28,58.55 v1(56.28,59.25)
$5N1124: length 54.5
  Top Layer w0.254: v1(56.64,66.98) 56.64,65.22 U7.27 ; v1(51.05,91.11) v1(51.05,88.57) ; R14.1 63.04,91.74 v1(63.04,91.74)
  Bottom Layer w0.254: v1(51.05,88.57) 53.47,86.16 62.23,86.16 62.67,85.71 62.67,82.28 64.64,80.31 64.64,72.82 59.77,67.94 57.61,67.94 v1(56.64,66.98) ; v1(51.05,91.11) 51.69,91.74 v1(63.04,91.74)
$5N1128: length 57.8
  Top Layer w0.254: v1(55.74,66.98) 56.22,66.5 U7.28 ; v1(49.91,91.11) 49.85,91.05 v1(49.85,88.76) ; R15.1 v1(63.24,93.43)
  Bottom Layer w0.254: v1(49.91,91.11) 52.23,93.43 v1(63.24,93.43) ; v1(55.74,66.98) 55.82,66.98 57.14,68.3 59.62,68.3 64.27,72.95 64.27,80.06 62.23,82.09 62.23,85.47 62.05,85.65 52.96,85.65 v1(49.85,88.76)
$5N1687: length 4.9
  Top Layer w0.254: X2.3 67.43,68.75 R16.1 67.43,73.15 C14.2
$5N2364: length 14.2
  Top Layer w0.254: SW_BOOT.2 67.07,74.91 68.27,74.91 68.45,74.73 68.45,65.07 R18.1

## Copper pours and planes (outline as drawn; the poured copper is in the pictures)
GND on Top Layer: 0,100 75,100 75,0 0,0
